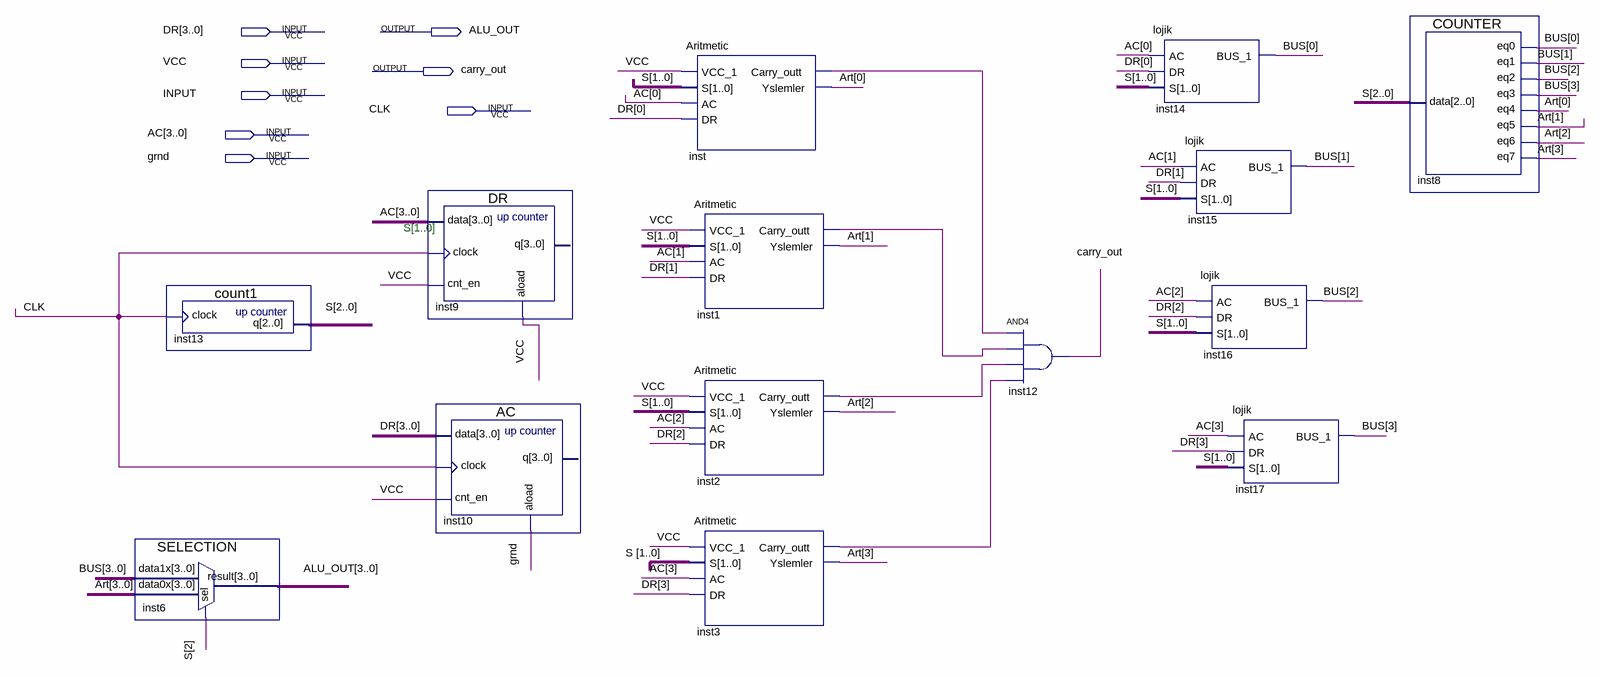
[diagram p0: schematic sheet]
// Quartus schematic Odev_1.bdf as structural Verilog: 14 symbols, 8 pins
module Odev_1 (
  input  [3:0] DR,
  input  VCC,
  input  INPUT,
  input  CLK,
  input  [3:0] AC,
  input  grnd,
  output ALU_OUT,
  output carry_out
);

  wire inst1_carry_outt, inst2_carry_outt, inst3_carry_outt, inst_carry_outt;
  wire [2:0] S;
  wire [3:0] ALU_OUT_bus, Art, BUS;

  SELECTION inst6 (.data1x(BUS), .data0x(Art), .sel(S[2]), .result(ALU_OUT_bus));
  count1 inst13 (.clock(CLK), .q(S));
  DR inst9 (.data(AC), .clock(CLK), .cnt_en(VCC), .aload(VCC));  // open: q
  AC inst10 (.data(DR), .clock(CLK), .cnt_en(VCC), .aload(grnd));  // open: q
  Aritmetic inst (.VCC_1(VCC), .S(S[1:0]), .AC(AC[0]), .DR(DR[0]), .Carry_outt(inst_carry_outt), .Yslemler(Art[0]));
  Aritmetic inst1 (.VCC_1(VCC), .S(S[1:0]), .AC(AC[1]), .DR(DR[1]), .Carry_outt(inst1_carry_outt), .Yslemler(Art[1]));
  Aritmetic inst2 (.VCC_1(VCC), .S(S[1:0]), .AC(AC[2]), .DR(DR[2]), .Carry_outt(inst2_carry_outt), .Yslemler(Art[2]));
  Aritmetic inst3 (.VCC_1(VCC), .S(S[1:0]), .AC(AC[3]), .DR(DR[3]), .Carry_outt(inst3_carry_outt), .Yslemler(Art[3]));
  and inst12 (carry_out, inst_carry_outt, inst1_carry_outt, inst2_carry_outt, inst3_carry_outt);
  lojik inst14 (.AC(AC[0]), .DR(DR[0]), .S(S[1:0]), .BUS_1(BUS[0]));
  lojik inst15 (.AC(AC[1]), .DR(DR[1]), .S(S[1:0]), .BUS_1(BUS[1]));
  lojik inst16 (.AC(AC[2]), .DR(DR[2]), .S(S[1:0]), .BUS_1(BUS[2]));
  lojik inst17 (.AC(AC[3]), .DR(DR[3]), .S(S[1:0]), .BUS_1(BUS[3]));
  COUNTER inst8 (
    .data(S), .eq0(BUS[0]), .eq1(BUS[1]), .eq2(BUS[2]), .eq3(BUS[3]), .eq4(Art[0]), .eq5(Art[1]),
    .eq6(Art[2]), .eq7(Art[3]));

  // Notes on the sheet:
  //   S[1..0]
endmodule
